# EAGLE schematic MHR17_SteeringWheel (EAGLE 8.0.1)
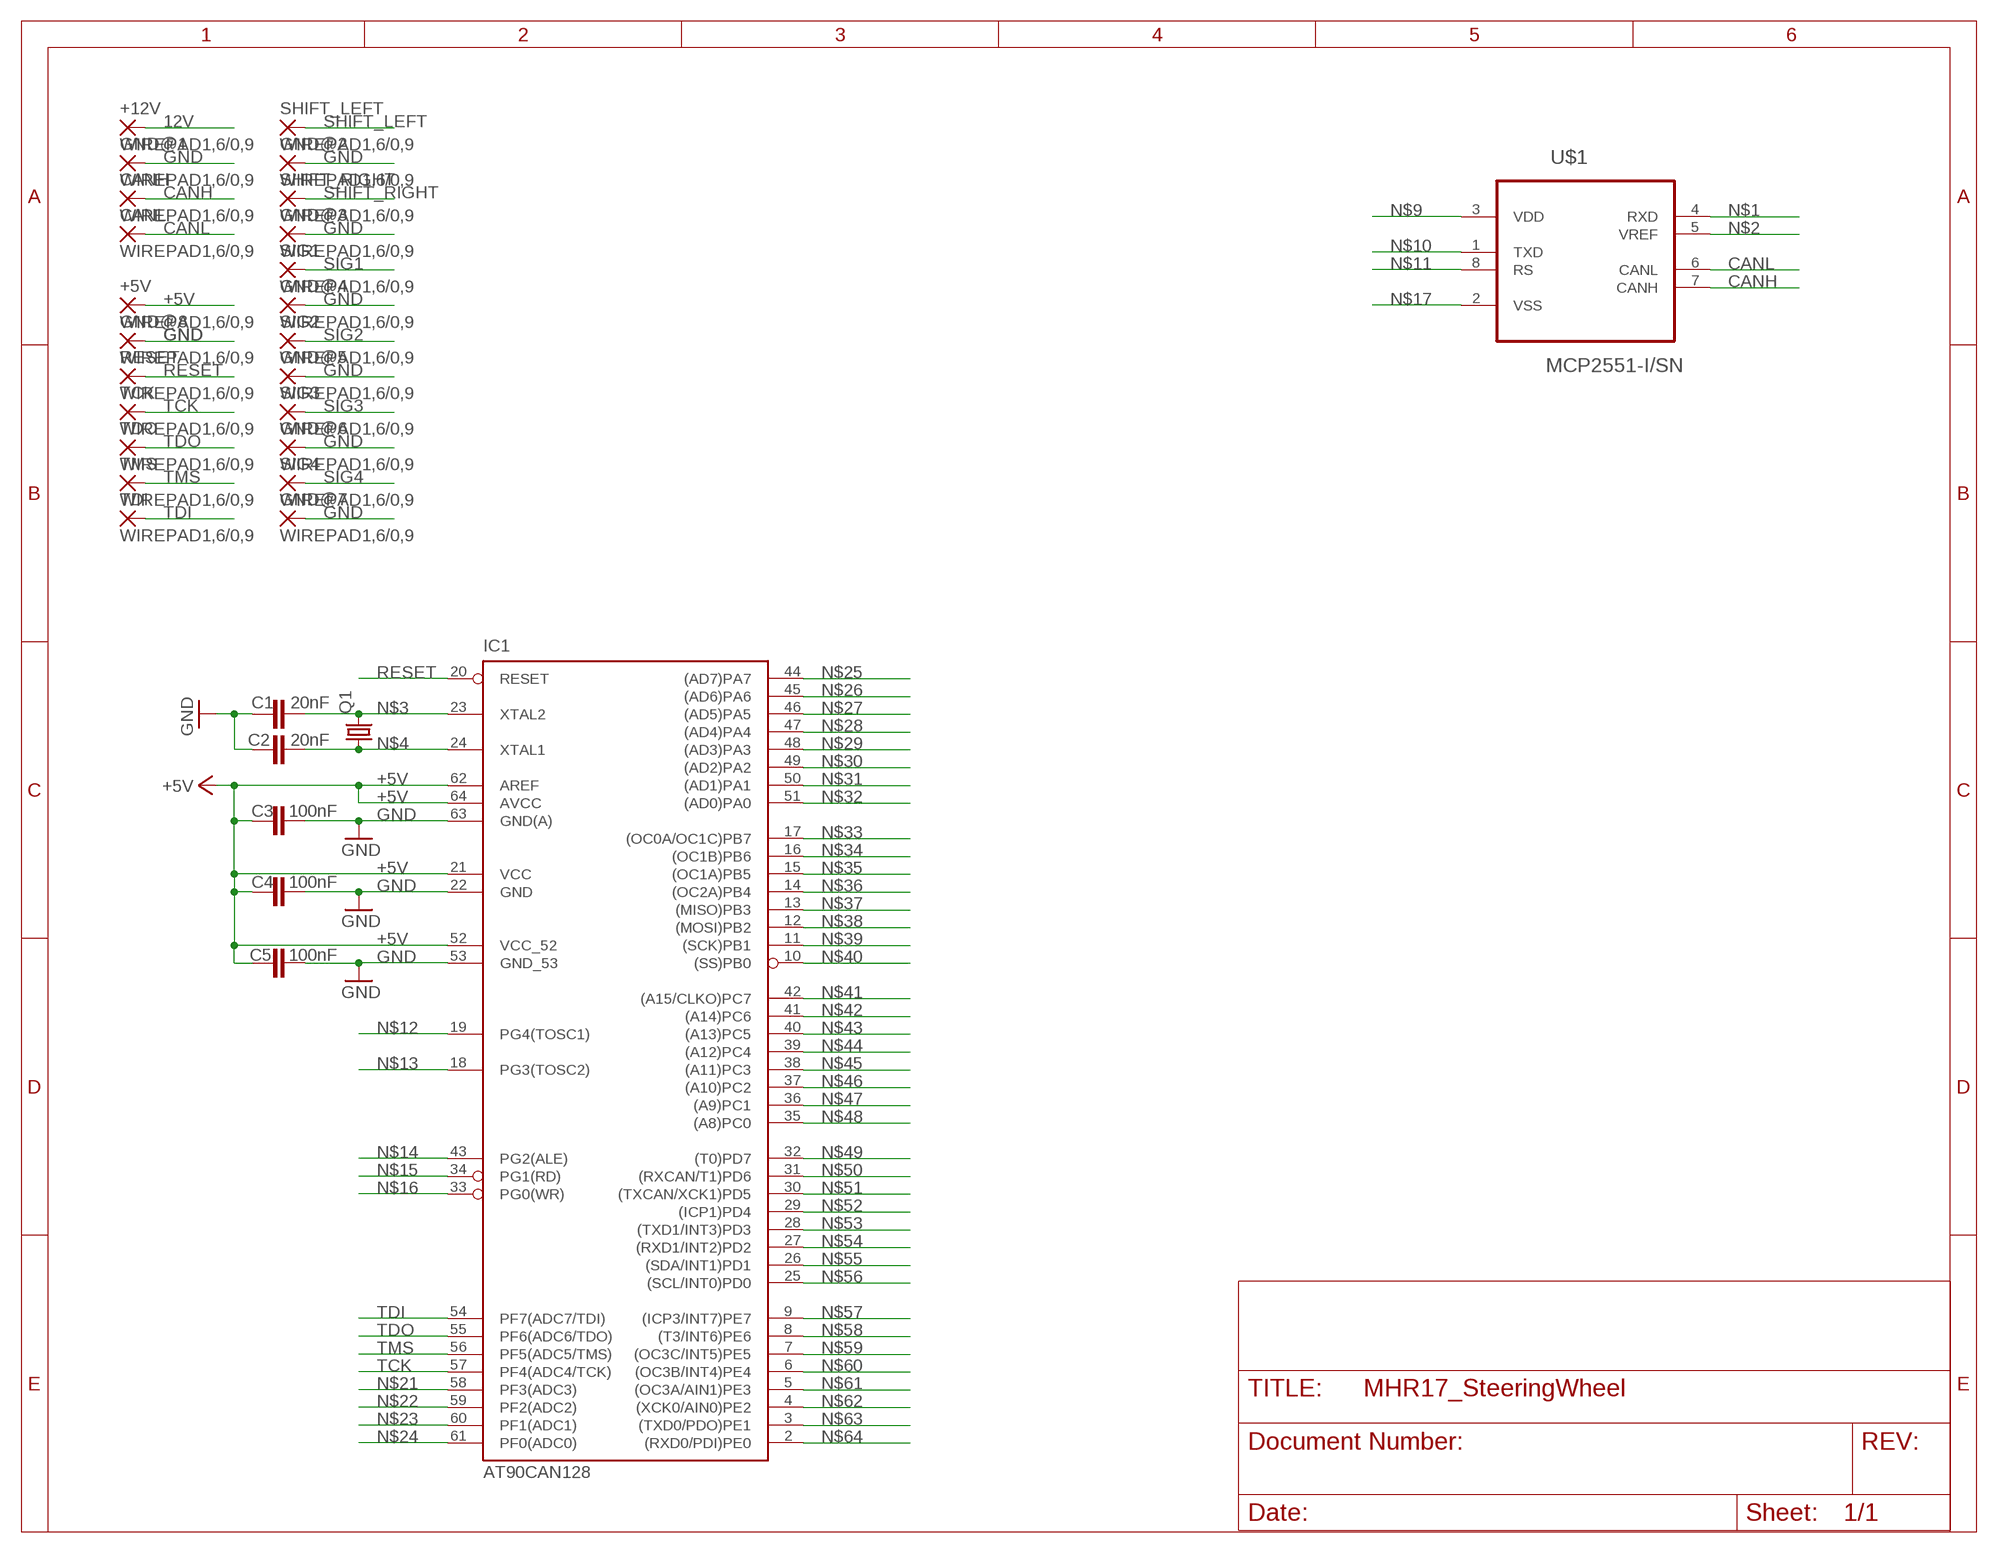
[diagram p0: schematic, sheet 1]

## Parts
+5V  WIREPAD1,6/0,9  [1,6/0,9]
+12V  WIREPAD1,6/0,9  [1,6/0,9]
C1  20nF  C-EUC0603  [C0603]
C2  20nF  C-EUC0603  [C0603]
C3  100nF  C-EUC0603  [C0603]
C4  100nF  C-EUC0603  [C0603]
C5  100nF  C-EUC0603  [C0603]
CANH  WIREPAD1,6/0,9  [1,6/0,9]
CANL  WIREPAD1,6/0,9  [1,6/0,9]
GND@1  WIREPAD1,6/0,9  [1,6/0,9]
GND@2  WIREPAD1,6/0,9  [1,6/0,9]
GND@3  WIREPAD1,6/0,9  [1,6/0,9]
GND@4  WIREPAD1,6/0,9  [1,6/0,9]
GND@5  WIREPAD1,6/0,9  [1,6/0,9]
GND@6  WIREPAD1,6/0,9  [1,6/0,9]
GND@7  WIREPAD1,6/0,9  [1,6/0,9]
GND@8  WIREPAD1,6/0,9  [1,6/0,9]
IC1  AT90CAN128  [TQFP64]
Q1  CRYSTALHC49S  [HC49/S]
RESET  WIREPAD1,6/0,9  [1,6/0,9]
SHIFT_LEFT  WIREPAD1,6/0,9  [1,6/0,9]
SHIFT_RIGHT  WIREPAD1,6/0,9  [1,6/0,9]
SIG1  WIREPAD1,6/0,9  [1,6/0,9]
SIG2  WIREPAD1,6/0,9  [1,6/0,9]
SIG3  WIREPAD1,6/0,9  [1,6/0,9]
SIG4  WIREPAD1,6/0,9  [1,6/0,9]
TCK  WIREPAD1,6/0,9  [1,6/0,9]
TDI  WIREPAD1,6/0,9  [1,6/0,9]
TDO  WIREPAD1,6/0,9  [1,6/0,9]
TMS  WIREPAD1,6/0,9  [1,6/0,9]
U$1  MCP2551-I/SN  [SOIC127P600X175-8N]

## Nets
12V: +12V.1(P)
+5V: +5V.1(P) C3.1 C4.1 C5.1 IC1.21(VCC) IC1.52(VCC_52) IC1.62(AREF) IC1.64(AVCC)
CANH: CANH.1(P) U$1.7(CANH)
CANL: CANL.1(P) U$1.6(CANL)
GND: C1.1 C2.1 C3.2 C4.2 C5.2 GND@1.1(P) GND@2.1(P) GND@3.1(P) GND@4.1(P) GND@5.1(P) GND@6.1(P) GND@7.1(P) GND@8.1(P) IC1.22(GND) IC1.53(GND_53) IC1.63(GND(A))
N$1: U$1.4(RXD)
N$2: U$1.5(VREF)
N$3: C1.2 IC1.23(XTAL2) Q1.2
N$4: C2.2 IC1.24(XTAL1) Q1.1
N$9: U$1.3(VDD)
N$10: U$1.1(TXD)
N$11: U$1.8(RS)
N$12: IC1.19(PG4(TOSC1))
N$13: IC1.18(PG3(TOSC2))
N$14: IC1.43(PG2(ALE))
N$15: IC1.34(PG1(RD))
N$16: IC1.33(PG0(WR))
N$17: U$1.2(VSS)
N$21: IC1.58(PF3(ADC3))
N$22: IC1.59(PF2(ADC2))
N$23: IC1.60(PF1(ADC1))
N$24: IC1.61(PF0(ADC0))
N$25: IC1.44((AD7)PA7)
N$26: IC1.45((AD6)PA6)
N$27: IC1.46((AD5)PA5)
N$28: IC1.47((AD4)PA4)
N$29: IC1.48((AD3)PA3)
N$30: IC1.49((AD2)PA2)
N$31: IC1.50((AD1)PA1)
N$32: IC1.51((AD0)PA0)
N$33: IC1.17((OC0A/OC1C)PB7)
N$34: IC1.16((OC1B)PB6)
N$35: IC1.15((OC1A)PB5)
N$36: IC1.14((OC2A)PB4)
N$37: IC1.13((MISO)PB3)
N$38: IC1.12((MOSI)PB2)
N$39: IC1.11((SCK)PB1)
N$40: IC1.10((SS)PB0)
N$41: IC1.42((A15/CLKO)PC7)
N$42: IC1.41((A14)PC6)
N$43: IC1.40((A13)PC5)
N$44: IC1.39((A12)PC4)
N$45: IC1.38((A11)PC3)
N$46: IC1.37((A10)PC2)
N$47: IC1.36((A9)PC1)
N$48: IC1.35((A8)PC0)
N$49: IC1.32((T0)PD7)
N$50: IC1.31((RXCAN/T1)PD6)
N$51: IC1.30((TXCAN/XCK1)PD5)
N$52: IC1.29((ICP1)PD4)
N$53: IC1.28((TXD1/INT3)PD3)
N$54: IC1.27((RXD1/INT2)PD2)
N$55: IC1.26((SDA/INT1)PD1)
N$56: IC1.25((SCL/INT0)PD0)
N$57: IC1.9((ICP3/INT7)PE7)
N$58: IC1.8((T3/INT6)PE6)
N$59: IC1.7((OC3C/INT5)PE5)
N$60: IC1.6((OC3B/INT4)PE4)
N$61: IC1.5((OC3A/AIN1)PE3)
N$62: IC1.4((XCK0/AIN0)PE2)
N$63: IC1.3((TXD0/PDO)PE1)
N$64: IC1.2((RXD0/PDI)PE0)
RESET: IC1.20(RESET) RESET.1(P)
SHIFT_LEFT: SHIFT_LEFT.1(P)
SHIFT_RIGHT: SHIFT_RIGHT.1(P)
SIG1: SIG1.1(P)
SIG2: SIG2.1(P)
SIG3: SIG3.1(P)
SIG4: SIG4.1(P)
TCK: IC1.57(PF4(ADC4/TCK)) TCK.1(P)
TDI: IC1.54(PF7(ADC7/TDI)) TDI.1(P)
TDO: IC1.55(PF6(ADC6/TDO)) TDO.1(P)
TMS: IC1.56(PF5(ADC5/TMS)) TMS.1(P)

## Library data of the parts
+5V +12V CANH CANL GND@1-GND@8 RESET SHIFT_LEFT SHIFT_RIGHT SIG1-SIG4 TCK TDI TDO TMS = wirepad:WIREPAD: Wire PAD connect wire on PCB
C1-C5 = rcl:C-EU: CAPACITOR, European symbol
IC1 = at90can128:AT90CAN128
Q1 = crystal:CRYSTAL: CRYSTAL; OC_FARNELL: 1667008; OC_NEWARK: unknown
U$1 = Microchip_By_element14_Batch_1:MCP2551-I/SN: High-Speed CAN Transceiver; MPN: MCP2551-I/SN; OC_FARNELL: 9758569; OC_NEWARK: 69K7604; PACKAGE: SOIC-8; SUPPLIER: Microchip